# EAGLE schematic akabeacon_square_type2 (EAGLE 7.2.0)
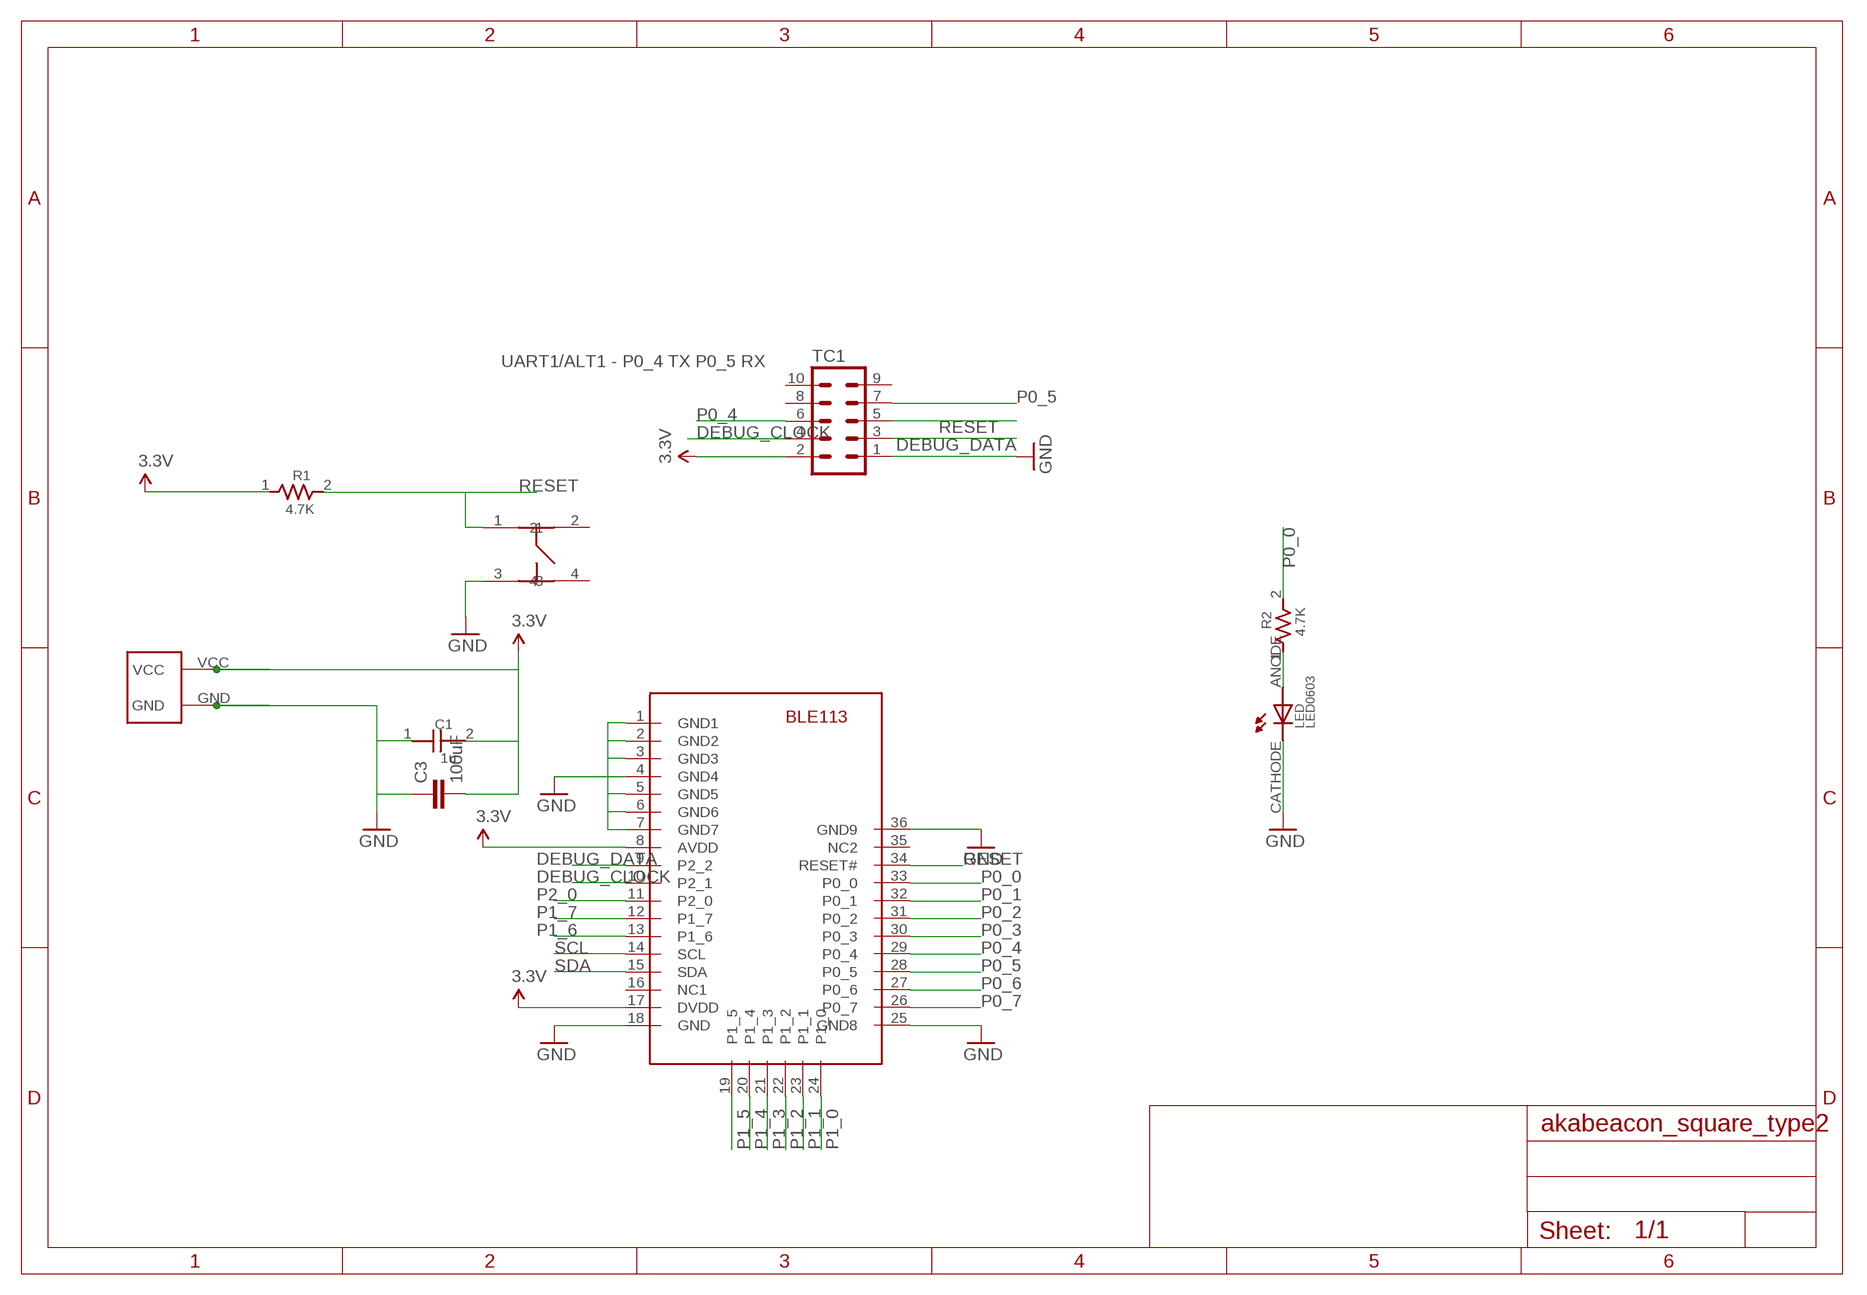
[diagram p0: schematic, sheet 1]

## Parts
C1  1u  CAPACITOR0603  [0603]
C3  100uF  10UF-6.3V-20%(1206)  [1206]
LED  LED0603  [0603]
R1  4.7K  RESISTOR0603  [0603]
R2  4.7K  RESISTOR0603  [0603]
TC1  TC2050-IDC-NL  [TC2050-IDC-NL]
U$3  SQUARE-TYPE2-TC2050  [SQUARE-TYPE2-TC2050]
U$5  BLE113  [BLE113]
U$6  SWICTH-4P(KMR2)  [SWITCH-4P(KMR2)]

## Nets
3.3V: C1.2 C3.2 R1.1 TC1.2 U$3.VCC U$5.8(AVDD) U$5.17(DVDD)
DEBUG_CLOCK: TC1.4 U$5.10(P2_1)
DEBUG_DATA: TC1.3 U$5.9(P2_2)
GND: C1.1 C3.1 LED.CATHODE TC1.1 U$3.GND U$5.1(GND1) U$5.2(GND2) U$5.3(GND3) U$5.4(GND4) U$5.5(GND5) U$5.6(GND6) U$5.7(GND7) U$5.18(GND) U$5.25(GND8) U$5.36(GND9) U$6.3
N$2: LED.ANODE R2.1
P0_0: R2.2 U$5.33(P0_0)
P0_1: U$5.32(P0_1)
P0_2: U$5.31(P0_2)
P0_3: U$5.30(P0_3)
P0_4: TC1.6 U$5.29(P0_4)
P0_5: TC1.7 U$5.28(P0_5)
P0_6: U$5.27(P0_6)
P0_7: U$5.26(P0_7)
P1_0: U$5.24(P1_0)
P1_1: U$5.23(P1_1)
P1_2: U$5.22(P1_2)
P1_3: U$5.21(P1_3)
P1_4: U$5.20(P1_4)
P1_5: U$5.19(P1_5)
P1_6: U$5.13(P1_6)
P1_7: U$5.12(P1_7)
P2_0: U$5.11(P2_0)
RESET: R1.2 TC1.5 U$5.34(RESET#) U$6.1
SCL: U$5.14(SCL)
SDA: U$5.15(SDA)
Unconnected: TC1.8 TC1.9 TC1.10 U$5.16(NC1) U$5.35(NC2) U$6.2 U$6.4

## Notes on the sheet
- UART1/ALT1 - P0_4 TX P0_5 RX

## Library data of the parts
C1 = GClue-Capacitor:CAPACITOR
C3 = SparkFun-Capacitors:10UF-6.3V-20%(1206): CAP-10057 Ceramic; PROD_ID: CAP-10057; VALUE: 10uF
LED = GClue-LED:LED
R1 R2 = GClue-Resistors:RESISTOR
TC1 = TagConnect:TC2050-IDC: Tag-Connect In Circuit Programming & Debug Cable 10 Pin http://www.tag-connect.com
U$3 = GClue-Beacon:SQUARE-TYPE2-TC2050
U$5 = gclue:BLE113
U$6 = gclue:SWICTH-4P(KMR2)